# EAGLE design switches (EAGLE 9.6.2)
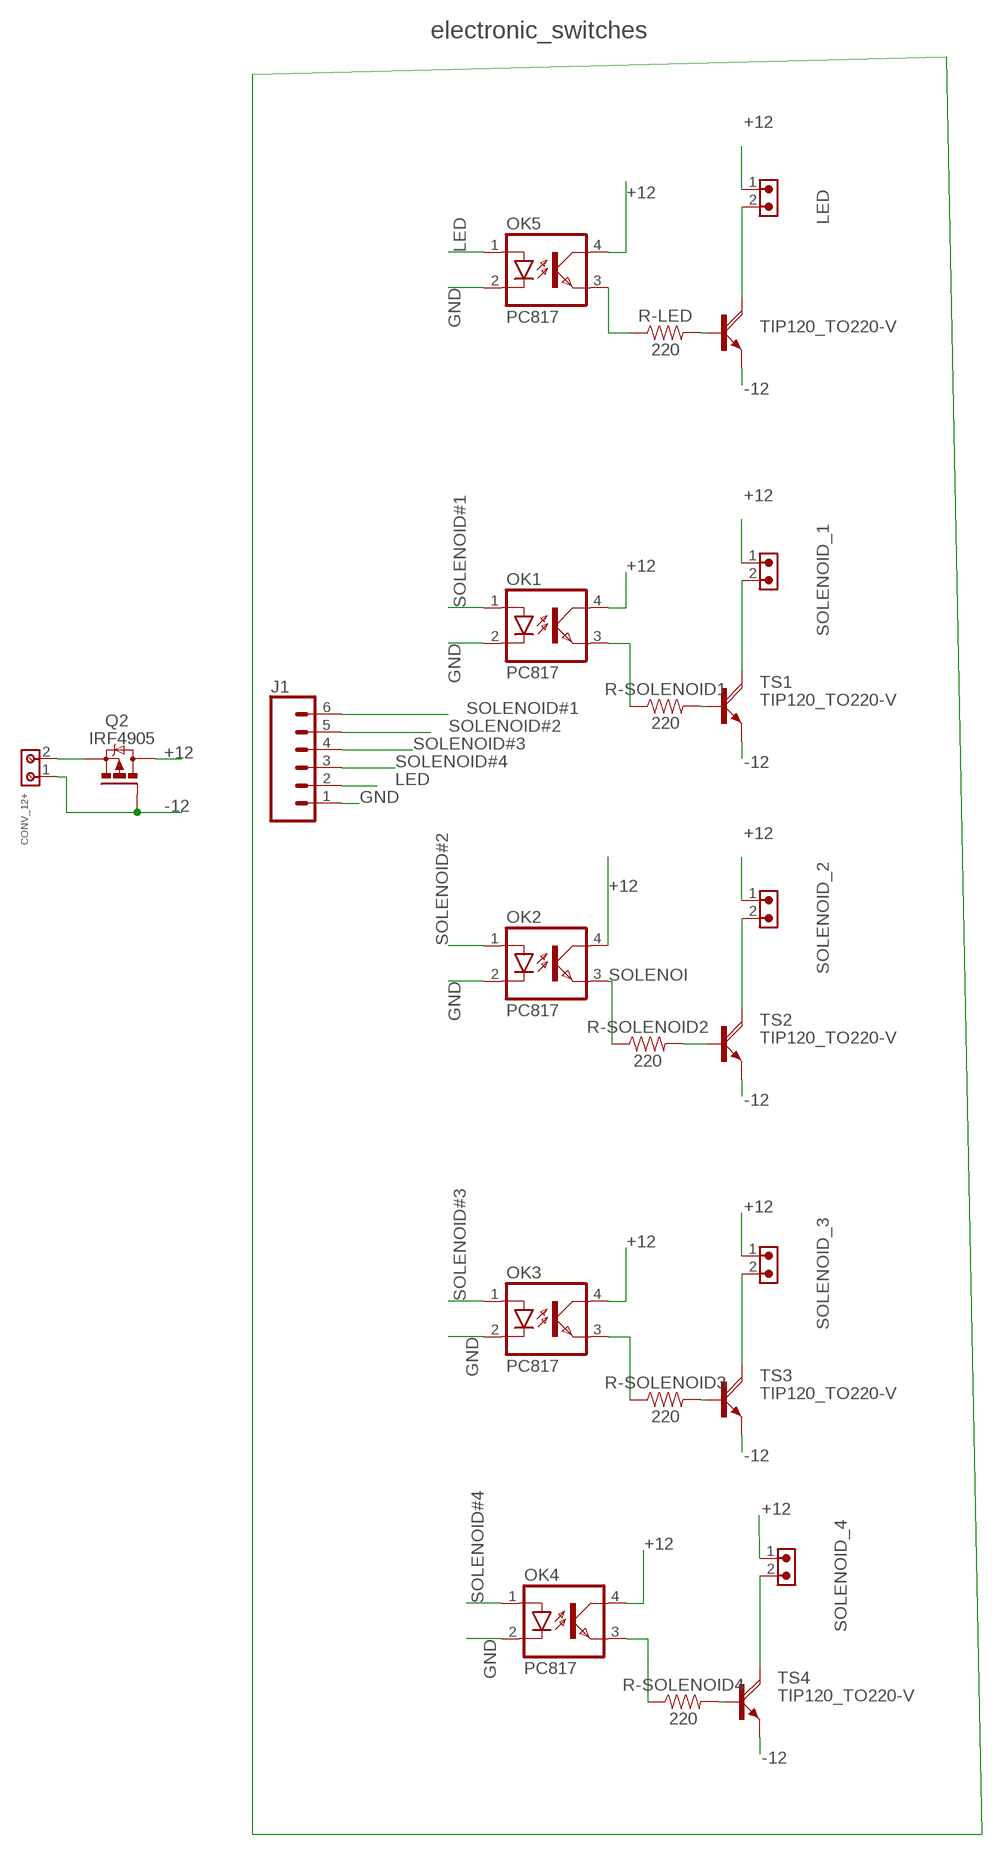
[diagram p0: schematic, sheet 1]

## Parts
CONV_12+  691213500002  [691213500002]
J1  CONN_06FEMALE_LOCK  [1X06_FEMALE_LOCK.010]
LED  691305540002  691305540002  [691305540002]
LED3  TIP120_TO220-V  [TO220V]
OK1  PC817  [DIL04]
OK2  PC817  [DIL04]
OK3  PC817  [DIL04]
OK4  PC817  [DIL04]
OK5  PC817  [DIL04]
Q2  IRF4905  [TO220BH]
R-LED  220  10MOHM-HORIZ-1/4W-5%  [AXIAL-0.3]
R-SOLENOID1  220  10MOHM-HORIZ-1/4W-5%  [AXIAL-0.3]
R-SOLENOID2  220  10MOHM-HORIZ-1/4W-5%  [AXIAL-0.3]
R-SOLENOID3  220  10MOHM-HORIZ-1/4W-5%  [AXIAL-0.3]
R-SOLENOID4  220  10MOHM-HORIZ-1/4W-5%  [AXIAL-0.3]
SOLENOID_1  691305540002  691305540002  [691305540002]
SOLENOID_2  691305540002  691305540002  [691305540002]
SOLENOID_3  691305540002  691305540002  [691305540002]
SOLENOID_4  691305540002  691305540002  [691305540002]
TS1  TIP120_TO220-V  [TO220V]
TS2  TIP120_TO220-V  [TO220V]
TS3  TIP120_TO220-V  [TO220V]
TS4  TIP120_TO220-V  [TO220V]

## Nets
+12: LED.1 OK1.4(COL) OK2.4(COL) OK3.4(COL) OK4.4(COL) OK5.4(COL) Q2.D SOLENOID_1.1 SOLENOID_2.1 SOLENOID_3.1 SOLENOID_4.1
-12: CONV_12+.1 LED3.3(E) Q2.G TS1.3(E) TS2.3(E) TS3.3(E) TS4.3(E)
GND: J1.1 OK1.2(C) OK2.2(C) OK3.2(C) OK4.2(C) OK5.2(C)
L1: OK3.3(EMIT) R-SOLENOID3.P$1
L2: OK4.3(EMIT) R-SOLENOID4.P$1
LED: J1.2 OK5.1(A)
N$1: SOLENOID_4.2 TS4.2(C)
N$2: R-SOLENOID4.P$2 TS4.1(B)
N$4: CONV_12+.2 Q2.S
N$11: LED3.2(C) LED.2
N$12: LED3.1(B) R-LED.P$2
N$15: SOLENOID_1.2 TS1.2(C)
N$16: R-SOLENOID1.P$2 TS1.1(B)
N$19: SOLENOID_2.2 TS2.2(C)
N$21: R-SOLENOID2.P$2 TS2.1(B)
N$22: SOLENOID_3.2 TS3.2(C)
N$23: R-SOLENOID3.P$2 TS3.1(B)
N$24: OK1.3(EMIT) R-SOLENOID1.P$1
N$25: OK5.3(EMIT) R-LED.P$1
SOLENOI: OK2.3(EMIT) R-SOLENOID2.P$1
SOLENOID#1: J1.6 OK1.1(A)
SOLENOID#2: J1.5 OK2.1(A)
SOLENOID#3: J1.4 OK3.1(A)
SOLENOID#4: J1.3 OK4.1(A)

## Notes on the sheet
- electronic_switches

## Library data of the parts
CONV_12+ = Wurth_Connectors_WR-TBL Rising Cage Clamp:691213500002: WR-TBL Serie 2135 - 5.08 mm Vertical Entry Modular w. Rising Cage Clamp KIND PROPERTIES Pitch 5.08 mm MATERIAL PROPERTIES Insulator Material PA66 Insulator Flammability Rating UL94 V-0 Contact Material Copper Alloy Contact Plating Tin over Nickel Terminal Screw Material Steel Terminal Screw Plating Zinc Wire Guard Material Copper Alloy GENERAL INFORMATION Operating Temperature -30 up to +120 °C Compliance RoHS ELECTRICAL PROPERTIES IR cULus 14 A IR VDE 14 A Working Voltage [cULus] 300 V (AC) Working Voltage [VDE] 250 V (AC) Withstanding Voltage [UL] 1600 V (AC) Withstanding Voltage [cULus] 1600 Withstanding Voltage [VDE] 2000 Contact Resistance [cULus] 20 mΩ Contact Resistance [VDE] 20 mΩ MECHANICAL PROPERTIES Wire Strip Length 6 Screw M3 CERTIFICATION cULus Approval E150931 VDE Approval 40021366 PACKAGING PROPERTIES Packaging Box <https://www.we-online.com/catalog/media/o58403v209%20Family_WR-TBL_5_08_2135_VERTICAL_CABLE_ENTRY_W_RISING_CLAMP_6912135000XX.jpg> Details see: https://www.we-online.com/catalog/en/TBL_5_08_2135_VERTICAL_CABLE_ENTRY_W_RISING_CLAMP_6912135000XX/ Updated by Ella Wu 2019-11-26 2019(C) Wurth Elektronik; IR-UL: 14A; IR-VDE: 14A; PART-NUMBER: 691213500002; PINS: 2; PITCH: 5.08mm; TYPE: Vertical; WIRE: 14 to 30 (AWG) 2.08 to 0.0509 (mm²); WORKING-VOLTAGE-UL: 300V (AC); WORKING-VOLTAGE-VDE: 250V (AC)
J1 = SparkFun-Connectors:CONN_06: Multi connection point. Often used as Generic Header-pin footprint for 0.1 inch spaced/style header connections On any of the 0.1 inch spaced packages, you can populate with these: Break Away Headers - Straight <https://www.sparkfun.com/products/116> (PRT-00116) Break Away Male Headers - Right Angle <https://www.sparkfun.com/products/553> (PRT-00553) Female Headers <https://www.sparkfun.com/products/115> (PRT-00115) Break Away Headers - Machine Pin <https://www.sparkfun.com/products/117> (PRT-00117) Break Away Female Headers - Swiss Machine Pin <https://www.sparkfun.com/products/743> (PRT-00743) Arduino Stackable Header - 6 Pin <https://www.sparkfun.com/products/9280> (PRT-09280) Screw Terminals 2.54mm Pitch (6-Pin) <https://www.sparkfun.com/products/16499> (PRT-16499) For SCREWTERMINALS and SPRING TERMINALS visit here: Screw Terimnals on SparkFun.com <https://www.sparkfun.com/search/results?term=Screw+Terminals> (5mm/3.5mm/2.54mm spacing) This device is also useful as a general connection point to wire up your design to another part of your project. Our various solder wires solder well into these plated through hole pads. Hook-Up Wire - Assortment (Stranded, 22 AWG) <https://www.sparkfun.com/products/11375> (PRT-11375) Hook-Up Wire - Assortment (Solid Core, 22 AWG) <https://www.sparkfun.com/products/11367> (PRT-11367) View the entire wire category on our website here <https://www.sparkfun.com/categories/141>
LED SOLENOID_1-SOLENOID_4 = Wurth_Connectors_WR-TBL Pluggable Connector:691305540002: WR-TBL Serie 3055 - 5.08 mm - PCB Header Horizontal Entry with Plastic Latches KIND PROPERTIES Pitch 5.08 mm MATERIAL PROPERTIES Insulator Material PA66 Insulator Flammability Rating UL94 V-0 Insulator Color Green Terminal Material Copper Alloy Terminal Plating Tin-plated surface GENERAL INFORMATION Operating Temperature -40 up to +105 °C ELECTRICAL PROPERTIES IR UL 16 A Working Voltage [UL] 300 V (AC) Withstanding Voltage [UL] 2500 V (AC) Contact Resistance [UL] 20 mΩ CERTIFICATION UL Approval E315414 <https://www.we-online.com/catalog/media/o135351v209%20Family_WR-TBL3_6913055400xx.jpg> Details see: https://www.we-online.com/catalog/en/TBL_5_08_3055_6913055400XX/ Updated by Ella Wu 2019-12-30 2019(C) Wurth Elektronik; DATASHEET-URL: https://www.we-online.com/catalog/datasheet/691305540002.pdf; IR-UL: 16A; MOUNT: THT; PART-NUMBER: 691305540002; PINS: 2; PITCH: 5.08mm; TYPE: Horizontal; WORKING-VOLTAGE-UL: 300V (AC)
LED3 TS1-TS4 = Tinkercad:TIP120: NPN DARLINGTON TRANSISTOR
OK1-OK5 = optocoupler:PC817: SHARP OPTO COUPLER; MPN: PC817X4J000F; OC_FARNELL: 9707727; OC_NEWARK: 97K7059
Q2 = transistor-power:IRF4905: P-Channel HEXFET® Power MOSFET RDS(on)= 0.02 Ohm, ID = -74A Source: http://www.irf.com/product-info/datasheets/data/irf4905pbf.pdf
R-LED R-SOLENOID1-R-SOLENOID4 = SparkFun-Resistors:10MOHM: RES-09327; PROD_ID: RES-09327; VALUE: 10M

## Board
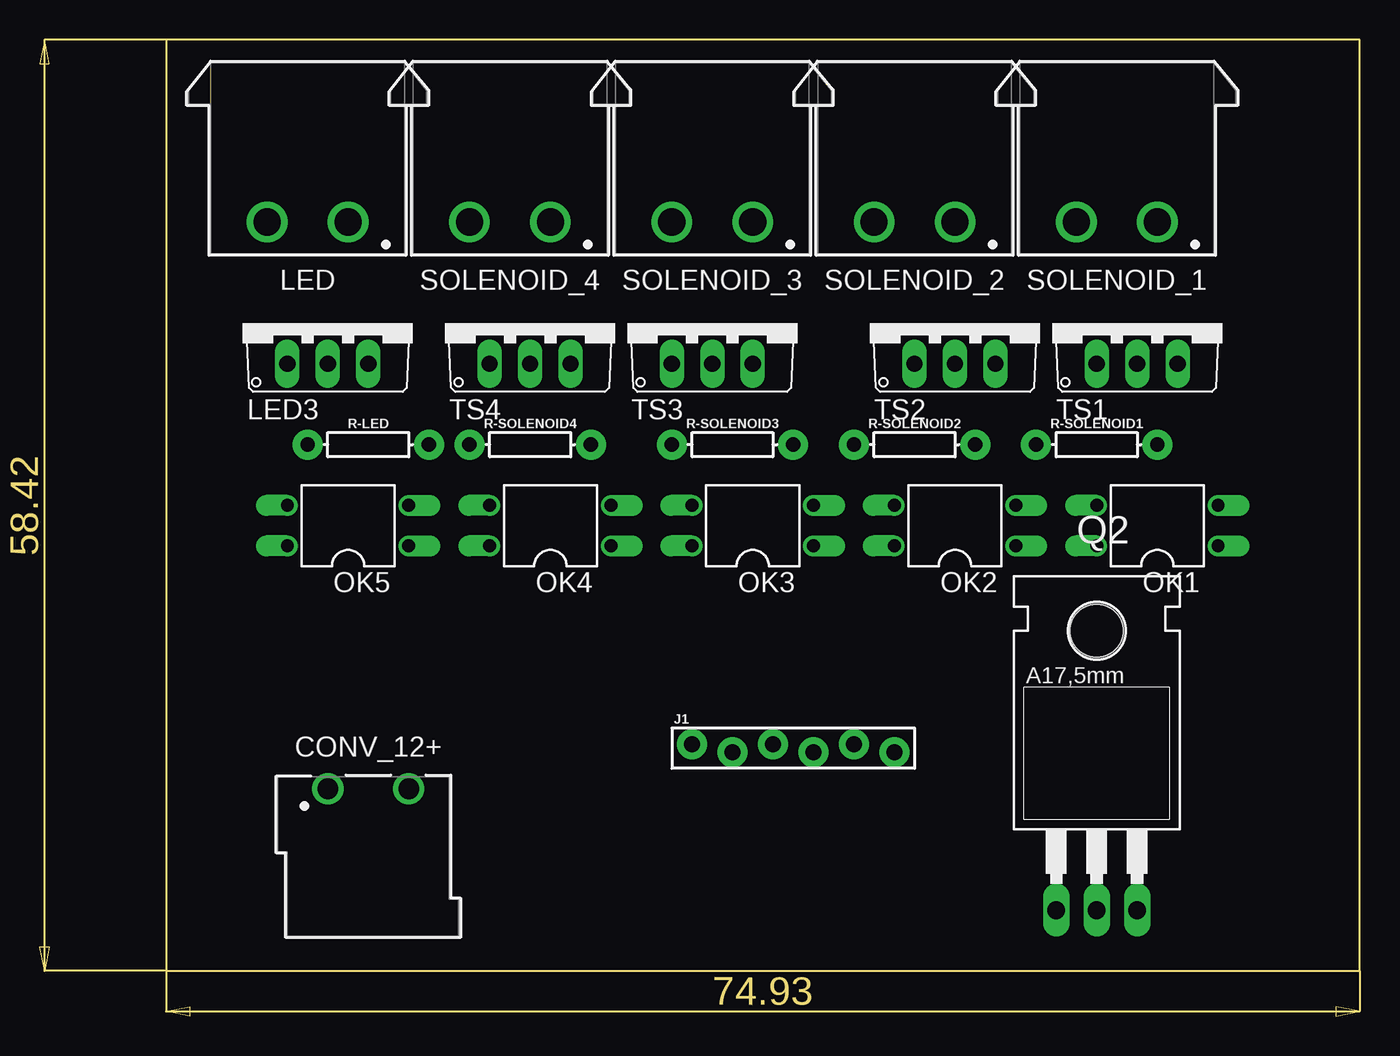
[diagram p1: board, top side]
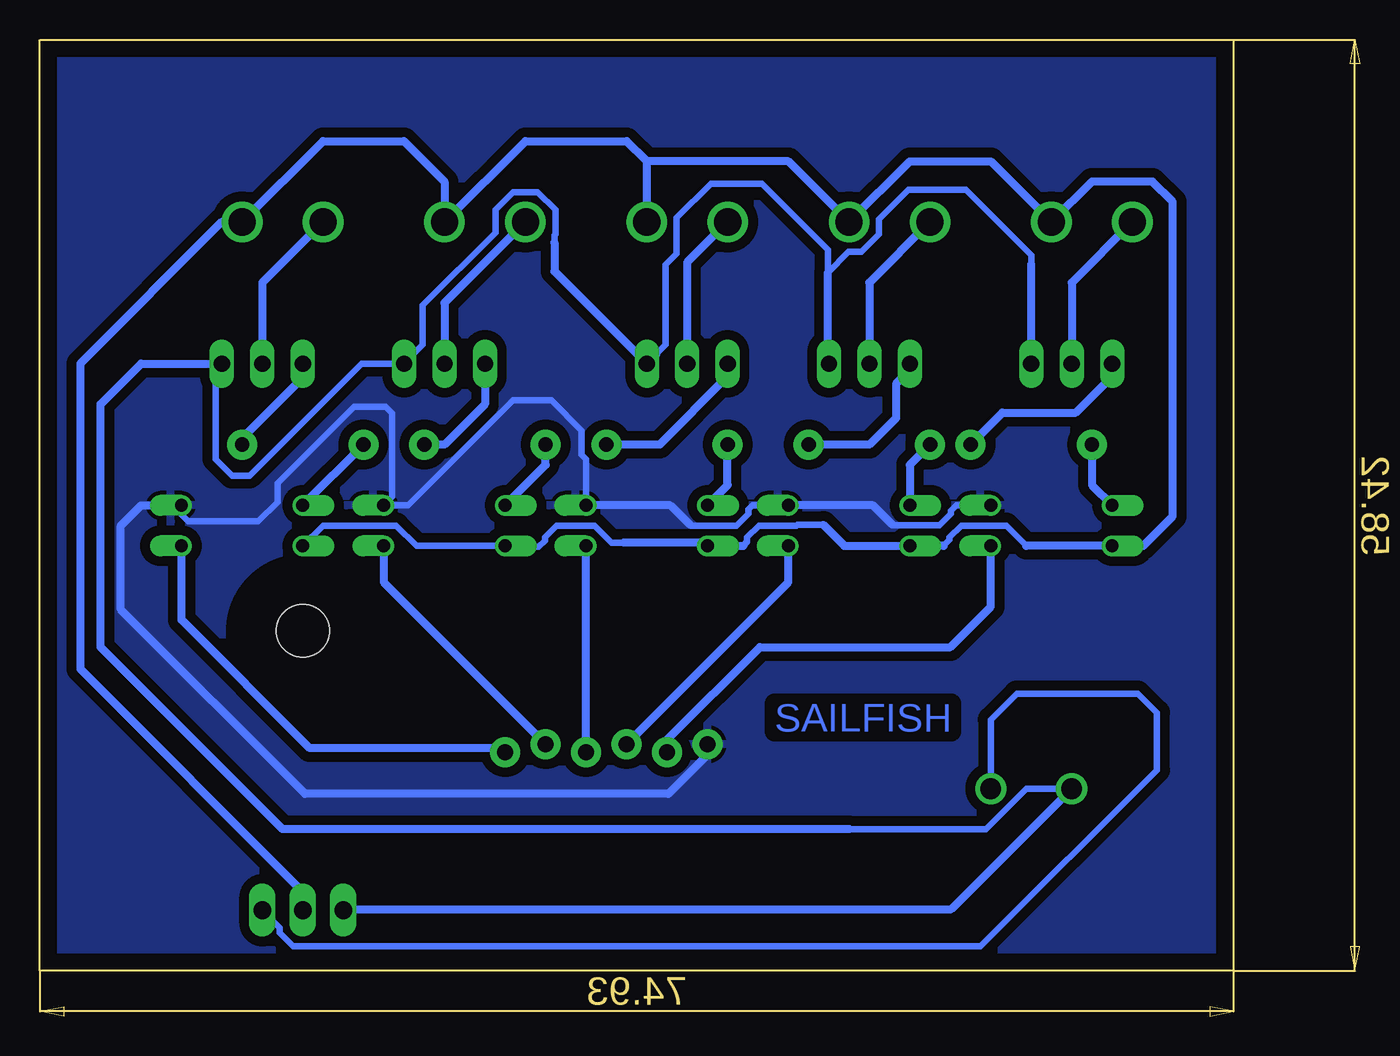
[diagram p2: board, bottom side, seen from below]

Size 74.93 x 58.42 mm. Coordinates in mm from the lower left corner, seen from the top.
Outline: 0,58.42 0,0 74.93,0 74.93,58.42 0,58.42
Copper layers (1*16): Top 0.035mm / dielectric 1.5mm / Bottom 0.035mm
Design rules "default *": minimum track width 0.4mm, minimum drill 0.35mm, track to track 0.4mm, track to pad 0.4mm, pad to pad 6mil, via to via 6mil, smd to smd 6mil, copper to edge 40mil, drill to drill 6mil, minimum pad ring 10mil, minimum via ring 8mil, stop-mask expansion 4mil, vias tented up to drill 0mil, thermal gap 10mil

### Footprints (pad centres in the part's own frame; a part is rotated, then mirrored left to right if it is on the bottom)
691213500002 = drill 1.3: 1 -2.54,0; 2 2.54,0
1X06_FEMALE_LOCK.010 = drill 1.016 pad 1.88: 1 0,0.254; 2 2.54,-0.254; 3 5.08,0.254; 4 7.62,-0.254; 5 10.16,0.254; 6 12.7,-0.254
691305540002 = drill 1.7: 1 -2.54,0; 2 2.54,0
TO220V = drill 1.016 long: 1 -2.54,-2.54; 2 0,-2.54; 3 2.54,-2.54
DIL04 = drill 0.813 offset: 1 -1.27,-3.81; 2 1.27,-3.81; 3 1.27,3.81; 4 -1.27,3.81
TO220BH = drill 1.118 long: D 0,-6.35; G -2.54,-6.35; S 2.54,-6.35 | hole 3.302: 0,11.176
AXIAL-0.3 = drill 0.9 pad 1.88: P$1 -3.81,0; P$2 3.81,0

### Placement (x,y rotation side)
CONV_12+  12.7,11.43 0 top
J1  33.02,13.97 0 top
LED  8.89,46.99 180 top
LED3  10.16,40.64 0 top
OK1  62.23,27.94 90 top
OK2  49.53,27.94 90 top
OK3  36.83,27.94 90 top
OK4  24.13,27.94 90 top
OK5  11.43,27.94 90 top
Q2  58.42,10.16 0 top
R-LED  12.7,33.02 0 top
R-SOLENOID1  58.42,33.02 0 top
R-SOLENOID2  46.99,33.02 0 top
R-SOLENOID3  35.56,33.02 0 top
R-SOLENOID4  22.86,33.02 0 top
SOLENOID_1  59.69,46.99 180 top
SOLENOID_2  46.99,46.99 180 top
SOLENOID_3  34.29,46.99 180 top
SOLENOID_4  21.59,46.99 180 top
TS1  60.96,40.64 0 top
TS2  49.53,40.64 0 top
TS3  34.29,40.64 0 top
TS4  22.86,40.64 0 top

### Tracks (layer width: path | path; a pad name or v marks a point on that pad's centre or on a via)
+12
  Bottom 0.406: OK1.4 57.15,27.94 52.55,27.94 51.28,26.67 OK2.4 45.65,26.6 43.61,26.6 43.22,26.99 43.22,27.19 42.48,27.93 40.12,27.93 39.05,26.87 38.28,26.87 | 25.74,27.98 27.39,27.98 27.43,27.93 29.78,27.93 30.52,27.19 30.52,26.91 30.77,26.67 | 13,26.67 14.27,27.93 17.08,27.93 17.82,27.19 17.82,27.04 18.2,26.67
  Bottom 0.508: 36.83,50.8 38.1,52.07 44.45,52.07 SOLENOID_2.1 49.53,49.53 52.07,52.07 57.15,52.07 SOLENOID_1.1 63.5,46.99 72.39,38.1 72.39,18.94 58.42,4.97 Q2.D | SOLENOID_3.1 36.83,50.8 | 36.83,50.8 27.94,50.8 SOLENOID_4.1 20.32,50.8 15.24,50.8 LED.1 8.89,49.53 5.08,49.53 3.81,48.26 3.81,28.53 5.67,26.67 OK5.4 13,26.67 | 18.2,26.67 OK4.4 24.43,26.67 25.74,27.98 | 30.77,26.67 OK3.4 33.22,26.87 38.28,26.87
-12
  Bottom 0.4: 12.7,44.32 12.7,44.89 16.81,49 20.41,49 | 34.95,46.21 34.95,45 35.65,44.3 35.65,39.28 TS3.3
  Bottom 0.406: 42.63,45.7 42.63,46.16 42.57,46.21 42.57,47.77 43.67,48.87 45.23,48.87 46.33,47.77 46.33,46.32 50.89,41.76 50.89,39.27 TS2.3 54.74,38.1 61.76,31.08 62.87,31.08 63.9,32.11 63.9,37.7 TS1.3 | 20.41,49 22.25,47.16 22.25,46.21 23.35,45.11 24.16,45.11 25.47,43.8 25.47,45.26 29.61,49.4 32.81,49.4 34.95,47.26 34.95,46.21 | CONV_12+.1 13.01,11.43 15.55,8.89 24.13,8.89
  Bottom 0.508: 42.63,45.7 42.63,43.9 TS3.3 36.22,38.71 | TS4.3 25.47,38.17 25.47,43.8 | CONV_12+.1 17.72,3.87 55.82,3.87 Q2.G | 24.13,8.89 59.69,8.89 71.12,20.32 71.12,35.56 68.58,38.1 TS1.3 | LED3.3 12.7,44.32
GND
  Bottom 0.406: OK1.2 66.04,28.63 65.61,28.2 61.21,28.2 60.01,29.4 60.01,30.6 55.21,35.4 53.21,35.4 52.81,35 52.81,29.74 OK2.2 51.8,29.21 45.21,35.8 42.81,35.8 40.91,33.9 40.91,32.38 40.64,32.11 OK3.2 | 34.14,28.01 34.06,27.93 31.19,27.93 30.44,28.69 30.44,28.97 30.2,29.21 OK4.2 | OK5.2 17.4,29.21 17.74,28.87 17.74,28.69 18.48,27.95 21.36,27.95 21.43,28.01
  Bottom 0.508: OK4.2 22.63,29.21 21.43,28.01 | OK3.2 35.34,29.21 34.14,28.01 | J1.1 33.02,13.55 35.47,11.1 58.28,11.1 69.85,22.67 69.85,27.94 68.58,29.21 OK1.2
  pour Bottom (isolate 0.61): 0,58.42 0,0 74.93,0 74.93,58.42
L1
  Bottom 0.508: OK3.3 31.75,30.48 R-SOLENOID3.P$1
L2
  Bottom 0.508: R-SOLENOID4.P$1 20.32,31.75 OK4.3
LED
  Bottom 0.508: J1.2 35.56,14.49 29.73,20.32 17.78,20.32 15.24,22.86 OK5.1
N$1
  Bottom 0.508: SOLENOID_4.2 22.86,43.18 TS4.2
N$2
  Bottom 0.508: TS4.1 20.32,37.7 21.19,36.83 21.19,34.69 22.86,33.02 R-SOLENOID4.P$2
N$4
  Bottom 0.406: Q2.S 59.86,2.71 59.86,2.38 59.02,1.53 15.88,1.53 4.81,12.6 4.81,16.2 6.01,17.4 13.61,17.4 15.24,15.77 CONV_12+.2
N$11
  Bottom 0.508: LED.2 10.16,43.18 LED3.2
N$12
  Bottom 0.508: LED3.1 7.62,37.3 9.9,35.02 14.51,35.02 R-LED.P$2
N$15
  Bottom 0.508: SOLENOID_1.2 60.96,43.18 TS1.2
N$16
  Bottom 0.508: R-SOLENOID1.P$2 62.23,33.42 58.42,37.23 TS1.1
N$19
  Bottom 0.508: SOLENOID_2.2 49.53,41.91 TS2.2
N$21
  Bottom 0.508: TS2.1 46.99,35.56 49.53,33.02 R-SOLENOID2.P$2
N$22
  Bottom 0.508: SOLENOID_3.2 34.29,44.45 TS3.2
N$23
  Bottom 0.508: TS3.1 31.75,37.3 36.03,33.02 R-SOLENOID3.P$2
N$24
  Bottom 0.508: R-SOLENOID1.P$1 OK1.3
N$25
  Bottom 0.508: R-LED.P$1 8.89,30.48 OK5.3
SOLENOI
  Bottom 0.508: OK2.3 43.18,31.75 R-SOLENOID2.P$1
SOLENOID#1
  Bottom 0.508: J1.6 45.97,13.97 57.99,13.97 66.04,22.02 OK1.1
SOLENOID#2
  Bottom 0.508: OK2.1 53.34,24.38 J1.5
SOLENOID#3
  Bottom 0.508: J1.4 OK3.1
SOLENOID#4
  Bottom 0.508: J1.3 27.94,24.38 OK4.1

### Text on the board
Bottom: SAILFISH